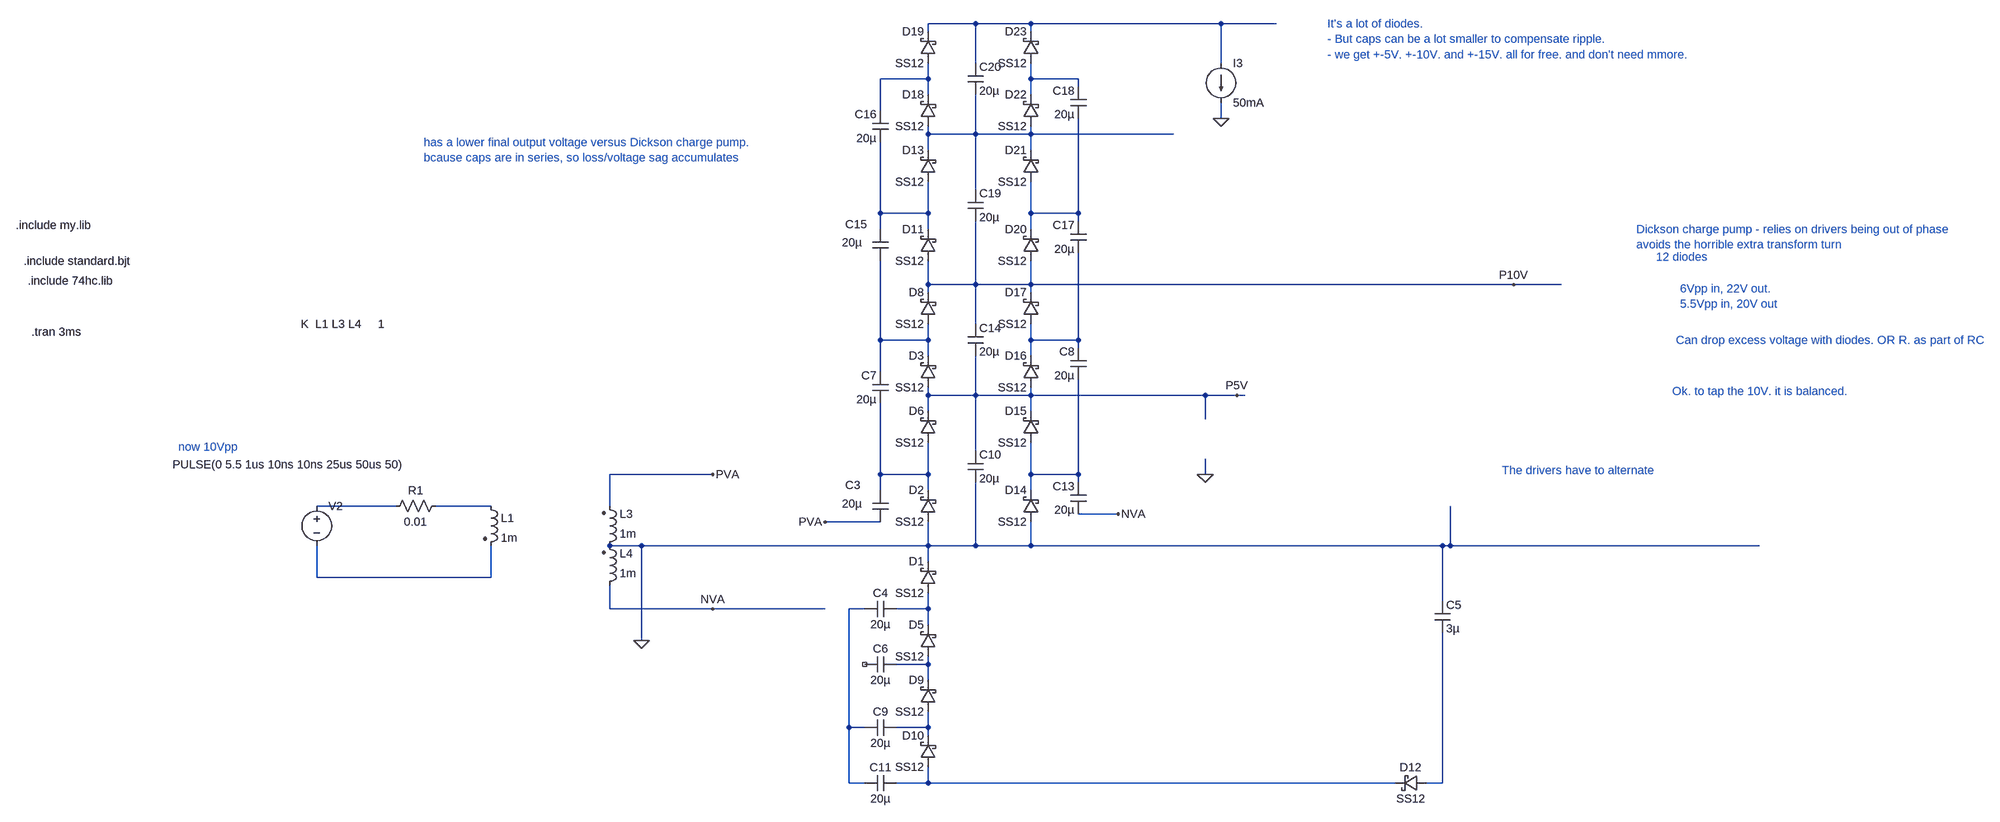
[diagram p0: schematic Draft102.asc]
Draft102.asc, the LTspice schematic file:
Version 4
SHEET 1 5720 1740
WIRE 2528 -1104 2432 -1104
WIRE 2640 -1104 2528 -1104
WIRE 3024 -1104 2640 -1104
WIRE 3136 -1104 3024 -1104
WIRE 2432 -1088 2432 -1104
WIRE 2640 -1088 2640 -1104
WIRE 2528 -1024 2528 -1104
WIRE 3024 -1024 3024 -1104
WIRE 2432 -992 2432 -1024
WIRE 2432 -992 2336 -992
WIRE 2640 -992 2640 -1024
WIRE 2736 -992 2640 -992
WIRE 2736 -976 2736 -992
WIRE 2432 -960 2432 -992
WIRE 2640 -960 2640 -992
WIRE 2336 -928 2336 -992
WIRE 3024 -912 3024 -944
WIRE 2432 -880 2432 -896
WIRE 2528 -880 2528 -960
WIRE 2528 -880 2432 -880
WIRE 2640 -880 2640 -896
WIRE 2640 -880 2528 -880
WIRE 2928 -880 2640 -880
WIRE 2432 -848 2432 -880
WIRE 2640 -848 2640 -880
WIRE 2528 -768 2528 -880
WIRE 2336 -720 2336 -864
WIRE 2432 -720 2432 -784
WIRE 2432 -720 2336 -720
WIRE 2640 -720 2640 -784
WIRE 2736 -720 2736 -912
WIRE 2736 -720 2640 -720
WIRE 2736 -704 2736 -720
WIRE 2336 -688 2336 -720
WIRE 2432 -688 2432 -720
WIRE 2640 -688 2640 -720
WIRE 2432 -576 2432 -624
WIRE 2528 -576 2528 -704
WIRE 2528 -576 2432 -576
WIRE 2640 -576 2640 -624
WIRE 2640 -576 2528 -576
WIRE 3632 -576 2640 -576
WIRE 3728 -576 3632 -576
WIRE 2432 -560 2432 -576
WIRE 2640 -560 2640 -576
WIRE 2528 -496 2528 -576
WIRE 2336 -464 2336 -624
WIRE 2432 -464 2432 -496
WIRE 2432 -464 2336 -464
WIRE 2640 -464 2640 -496
WIRE 2736 -464 2736 -640
WIRE 2736 -464 2640 -464
WIRE 2736 -448 2736 -464
WIRE 2432 -432 2432 -464
WIRE 2640 -432 2640 -464
WIRE 2336 -400 2336 -464
WIRE 2432 -352 2432 -368
WIRE 2528 -352 2528 -432
WIRE 2528 -352 2432 -352
WIRE 2640 -352 2640 -368
WIRE 2640 -352 2528 -352
WIRE 2992 -352 2640 -352
WIRE 3056 -352 2992 -352
WIRE 3072 -352 3056 -352
WIRE 2432 -320 2432 -352
WIRE 2640 -320 2640 -352
WIRE 2992 -304 2992 -352
WIRE 2528 -240 2528 -352
WIRE 1952 -192 1744 -192
WIRE 2336 -192 2336 -336
WIRE 2432 -192 2432 -256
WIRE 2432 -192 2336 -192
WIRE 2640 -192 2640 -256
WIRE 2736 -192 2736 -384
WIRE 2736 -192 2640 -192
WIRE 2992 -192 2992 -224
WIRE 2736 -176 2736 -192
WIRE 2336 -160 2336 -192
WIRE 2432 -160 2432 -192
WIRE 2640 -160 2640 -192
WIRE 1312 -128 1152 -128
WIRE 1504 -128 1392 -128
WIRE 1744 -128 1744 -192
WIRE 2816 -112 2736 -112
WIRE 2336 -96 2224 -96
WIRE 1808 -48 1744 -48
WIRE 2432 -48 2432 -96
WIRE 2432 -48 1808 -48
WIRE 2528 -48 2528 -176
WIRE 2528 -48 2432 -48
WIRE 2640 -48 2640 -96
WIRE 2640 -48 2528 -48
WIRE 3488 -48 2640 -48
WIRE 3504 -48 3504 -128
WIRE 3504 -48 3488 -48
WIRE 4128 -48 3504 -48
WIRE 2432 -16 2432 -48
WIRE 1152 16 1152 -48
WIRE 1504 16 1504 -48
WIRE 1504 16 1152 16
WIRE 3488 64 3488 -48
WIRE 1744 80 1744 32
WIRE 1952 80 1744 80
WIRE 2224 80 1952 80
WIRE 2304 80 2272 80
WIRE 2432 80 2432 48
WIRE 2432 80 2368 80
WIRE 2432 112 2432 80
WIRE 1808 144 1808 -48
WIRE 2432 192 2432 176
WIRE 2432 192 2368 192
WIRE 2432 224 2432 192
WIRE 2272 320 2272 80
WIRE 2304 320 2272 320
WIRE 2432 320 2432 288
WIRE 2432 320 2368 320
WIRE 2432 336 2432 320
WIRE 2272 432 2272 320
WIRE 2304 432 2272 432
WIRE 2432 432 2432 400
WIRE 2432 432 2368 432
WIRE 3392 432 2432 432
WIRE 3488 432 3488 128
WIRE 3488 432 3456 432
FLAG 1808 144 0
FLAG 3632 -576 P10V
FLAG 3024 -912 0
FLAG 2992 -192 0
FLAG 1952 -192 PVA
FLAG 1952 80 NVA
FLAG 2224 -96 PVA
FLAG 2816 -112 NVA
FLAG 3056 -352 P5V
SYMBOL ind2 1728 -32 M180
WINDOW 0 36 80 Left 2
WINDOW 3 36 40 Left 2
SYMATTR InstName L3
SYMATTR Value 1m
SYMATTR Type ind
SYMBOL ind2 1728 48 M180
WINDOW 0 36 80 Left 2
WINDOW 3 36 40 Left 2
SYMATTR InstName L4
SYMATTR Value 1m
SYMATTR Type ind
SYMBOL ind2 1488 -144 R0
SYMATTR InstName L1
SYMATTR Value 1m
SYMATTR Type ind
SYMBOL voltage 1152 -144 R0
WINDOW 123 0 0 Left 0
WINDOW 39 0 0 Left 0
WINDOW 3 -291 -68 Left 2
SYMATTR Value PULSE(0 5.5 1us 10ns 10ns 25us 50us 50)
SYMATTR InstName V2
SYMBOL cap 2320 -160 R0
WINDOW 0 -55 -10 Left 2
WINDOW 3 -62 27 Left 2
SYMATTR InstName C3
SYMATTR Value 20µ
SYMBOL cap 2368 64 R90
WINDOW 0 0 32 VBottom 2
WINDOW 3 32 32 VTop 2
SYMATTR InstName C4
SYMATTR Value 20µ
SYMBOL cap 3472 64 R0
SYMATTR InstName C5
SYMATTR Value 3µ
SYMBOL current 3024 -1024 R0
WINDOW 123 0 0 Left 0
WINDOW 39 0 0 Left 0
SYMATTR InstName I3
SYMATTR Value 50mA
SYMBOL schottky 2448 -96 R180
WINDOW 0 24 64 Left 2
WINDOW 3 24 0 Left 2
SYMATTR InstName D2
SYMATTR Value SS12
SYMATTR Description Diode
SYMATTR Type diode
SYMBOL schottky 2448 176 R180
WINDOW 0 24 64 Left 2
WINDOW 3 24 0 Left 2
SYMATTR InstName D5
SYMATTR Value SS12
SYMATTR Description Diode
SYMATTR Type diode
SYMBOL schottky 2448 48 R180
WINDOW 0 24 64 Left 2
WINDOW 3 24 0 Left 2
SYMATTR InstName D1
SYMATTR Value SS12
SYMATTR Description Diode
SYMATTR Type diode
SYMBOL schottky 2448 -256 R180
WINDOW 0 24 64 Left 2
WINDOW 3 24 0 Left 2
SYMATTR InstName D6
SYMATTR Value SS12
SYMATTR Description Diode
SYMATTR Type diode
SYMBOL schottky 2448 -368 R180
WINDOW 0 24 64 Left 2
WINDOW 3 24 0 Left 2
SYMATTR InstName D3
SYMATTR Value SS12
SYMATTR Description Diode
SYMATTR Type diode
SYMBOL schottky 2448 288 R180
WINDOW 0 24 64 Left 2
WINDOW 3 24 0 Left 2
SYMATTR InstName D9
SYMATTR Value SS12
SYMATTR Description Diode
SYMATTR Type diode
SYMBOL res 1408 -144 R90
WINDOW 0 0 56 VBottom 2
WINDOW 3 32 56 VTop 2
SYMATTR InstName R1
SYMATTR Value 0.01
SYMBOL cap 2368 176 R90
WINDOW 0 0 32 VBottom 2
WINDOW 3 32 32 VTop 2
SYMATTR InstName C6
SYMATTR Value 20µ
SYMBOL schottky 2448 -496 R180
WINDOW 0 24 64 Left 2
WINDOW 3 24 0 Left 2
SYMATTR InstName D8
SYMATTR Value SS12
SYMATTR Description Diode
SYMATTR Type diode
SYMBOL cap 2352 -336 R180
WINDOW 0 24 56 Left 2
WINDOW 3 24 8 Left 2
SYMATTR InstName C7
SYMATTR Value 20µ
SYMBOL cap 2368 304 R90
WINDOW 0 0 32 VBottom 2
WINDOW 3 32 32 VTop 2
SYMATTR InstName C9
SYMATTR Value 20µ
SYMBOL schottky 2448 400 R180
WINDOW 0 24 64 Left 2
WINDOW 3 24 0 Left 2
SYMATTR InstName D10
SYMATTR Value SS12
SYMATTR Description Diode
SYMATTR Type diode
SYMBOL cap 2368 416 R90
WINDOW 0 0 32 VBottom 2
WINDOW 3 32 32 VTop 2
SYMATTR InstName C11
SYMATTR Value 20µ
SYMBOL schottky 3456 416 R90
WINDOW 0 0 32 VBottom 2
WINDOW 3 32 32 VTop 2
SYMATTR InstName D12
SYMATTR Value SS12
SYMATTR Description Diode
SYMATTR Type diode
SYMBOL schottky 2656 -96 R180
WINDOW 0 24 64 Left 2
WINDOW 3 24 0 Left 2
SYMATTR InstName D14
SYMATTR Value SS12
SYMATTR Description Diode
SYMATTR Type diode
SYMBOL schottky 2656 -256 R180
WINDOW 0 24 64 Left 2
WINDOW 3 24 0 Left 2
SYMATTR InstName D15
SYMATTR Value SS12
SYMATTR Description Diode
SYMATTR Type diode
SYMBOL schottky 2656 -368 R180
WINDOW 0 24 64 Left 2
WINDOW 3 24 0 Left 2
SYMATTR InstName D16
SYMATTR Value SS12
SYMATTR Description Diode
SYMATTR Type diode
SYMBOL schottky 2656 -496 R180
WINDOW 0 24 64 Left 2
WINDOW 3 24 0 Left 2
SYMATTR InstName D17
SYMATTR Value SS12
SYMATTR Description Diode
SYMATTR Type diode
SYMBOL cap 2752 -112 R180
WINDOW 0 24 56 Left 2
WINDOW 3 24 8 Left 2
SYMATTR InstName C13
SYMATTR Value 20µ
SYMBOL cap 2752 -384 R180
WINDOW 0 24 56 Left 2
WINDOW 3 24 8 Left 2
SYMATTR InstName C8
SYMATTR Value 20µ
SYMBOL cap 2512 -240 R0
SYMATTR InstName C10
SYMATTR Value 20µ
SYMBOL cap 2512 -496 R0
SYMATTR InstName C14
SYMATTR Value 20µ
SYMBOL cap 2320 -688 R0
WINDOW 0 -55 -10 Left 2
WINDOW 3 -62 27 Left 2
SYMATTR InstName C15
SYMATTR Value 20µ
SYMBOL schottky 2448 -624 R180
WINDOW 0 24 64 Left 2
WINDOW 3 24 0 Left 2
SYMATTR InstName D11
SYMATTR Value SS12
SYMATTR Description Diode
SYMATTR Type diode
SYMBOL schottky 2448 -784 R180
WINDOW 0 24 64 Left 2
WINDOW 3 24 0 Left 2
SYMATTR InstName D13
SYMATTR Value SS12
SYMATTR Description Diode
SYMATTR Type diode
SYMBOL schottky 2448 -896 R180
WINDOW 0 24 64 Left 2
WINDOW 3 24 0 Left 2
SYMATTR InstName D18
SYMATTR Value SS12
SYMATTR Description Diode
SYMATTR Type diode
SYMBOL schottky 2448 -1024 R180
WINDOW 0 24 64 Left 2
WINDOW 3 24 0 Left 2
SYMATTR InstName D19
SYMATTR Value SS12
SYMATTR Description Diode
SYMATTR Type diode
SYMBOL cap 2352 -864 R180
WINDOW 0 24 56 Left 2
WINDOW 3 24 8 Left 2
SYMATTR InstName C16
SYMATTR Value 20µ
SYMBOL schottky 2656 -624 R180
WINDOW 0 24 64 Left 2
WINDOW 3 24 0 Left 2
SYMATTR InstName D20
SYMATTR Value SS12
SYMATTR Description Diode
SYMATTR Type diode
SYMBOL schottky 2656 -784 R180
WINDOW 0 24 64 Left 2
WINDOW 3 24 0 Left 2
SYMATTR InstName D21
SYMATTR Value SS12
SYMATTR Description Diode
SYMATTR Type diode
SYMBOL schottky 2656 -896 R180
WINDOW 0 24 64 Left 2
WINDOW 3 24 0 Left 2
SYMATTR InstName D22
SYMATTR Value SS12
SYMATTR Description Diode
SYMATTR Type diode
SYMBOL schottky 2656 -1024 R180
WINDOW 0 24 64 Left 2
WINDOW 3 24 0 Left 2
SYMATTR InstName D23
SYMATTR Value SS12
SYMATTR Description Diode
SYMATTR Type diode
SYMBOL cap 2752 -640 R180
WINDOW 0 24 56 Left 2
WINDOW 3 24 8 Left 2
SYMATTR InstName C17
SYMATTR Value 20µ
SYMBOL cap 2752 -912 R180
WINDOW 0 24 56 Left 2
WINDOW 3 24 8 Left 2
SYMATTR InstName C18
SYMATTR Value 20µ
SYMBOL cap 2512 -768 R0
SYMATTR InstName C19
SYMATTR Value 20µ
SYMBOL cap 2512 -1024 R0
SYMATTR InstName C20
SYMATTR Value 20µ
TEXT 576 -480 Left 2 !.tran 3ms
TEXT 1120 -496 Left 2 !K  L1 L3 L4     1
TEXT 560 -624 Left 2 !.include standard.bjt
TEXT 544 -696 Left 2 !.include my.lib
TEXT 568 -584 Left 2 !.include 74hc.lib
TEXT 872 -248 Left 2 ;now 10Vpp
TEXT 3608 -200 Left 2 ;The drivers have to alternate
TEXT 3880 -688 Left 2 ;Dickson charge pump - relies on drivers being out of phase\navoids the horrible extra transform turn
TEXT 3920 -632 Left 2 ;12 diodes
TEXT 3968 -568 Left 2 ;6Vpp in, 22V out.\n5.5Vpp in, 20V out
TEXT 3960 -464 Left 2 ;Can drop excess voltage with diodes. OR R. as part of RC
TEXT 3952 -360 Left 2 ;Ok. to tap the 10V. it is balanced.
TEXT 3256 -1104 Left 2 ;It's a lot of diodes.\n- But caps can be a lot smaller to compensate ripple.\n- we get +-5V. +-10V. and +-15V. all for free. and don't need mmore.
TEXT 1368 -864 Left 2 ;has a lower final output voltage versus Dickson charge pump.\nbcause caps are in series, so loss/voltage sag accumulates

The netlist it stands for:
* Draft102.asc
L3 0 PVA 1m
L4 NVA 0 1m
L1 N012 N013 1m
V2 N011 N013 PULSE(0 5.5 1us 10ns 10ns 25us 50us 50)
C3 N009 PVA 20µ
C4 N015 N014 20µ
C5 0 N019 3µ
I3 N001 0 50mA
D2 0 N009 SS12
D5 N016 N015 SS12
D1 N015 0 SS12
D6 N009 P5V SS12
D3 P5V N007 SS12
D9 N017 N016 SS12
R1 N012 N011 0.01
C6 N016 NC_01 20µ
D8 N007 P10V SS12
C7 N009 N007 20µ
C9 N017 N014 20µ
D10 N018 N017 SS12
C11 N018 N014 20µ
D12 N019 N018 SS12
D14 0 N010 SS12
D15 N010 P5V SS12
D16 P5V N008 SS12
D17 N008 P10V SS12
C13 NVA N010 20µ
C8 N010 N008 20µ
C10 P5V 0 20µ
C14 P10V P5V 20µ
C15 N005 N007 20µ
D11 P10V N005 SS12
D13 N005 N004 SS12
D18 N004 N002 SS12
D19 N002 N001 SS12
C16 N005 N002 20µ
D20 P10V N006 SS12
D21 N006 N004 SS12
D22 N004 N003 SS12
D23 N003 N001 SS12
C17 N008 N006 20µ
C18 N006 N003 20µ
C19 N004 P10V 20µ
C20 N001 N004 20µ
.model D D
.lib standard.dio
.tran 3ms
K  L1 L3 L4     1
.include standard.bjt
.include my.lib
.include 74hc.lib
* now 10Vpp
* The drivers have to alternate
* Dickson charge pump - relies on drivers being out of phase
* avoids the horrible extra transform turn
* 12 diodes
* 6Vpp in, 22V out.
* 5.5Vpp in, 20V out
* Can drop excess voltage with diodes. OR R. as part of RC
* Ok. to tap the 10V. it is balanced.
* It's a lot of diodes.
* - But caps can be a lot smaller to compensate ripple.
* - we get +-5V. +-10V. and +-15V. all for free. and don't need mmore.
* has a lower final output voltage versus Dickson charge pump.
* bcause caps are in series, so loss/voltage sag accumulates
.backanno
.end